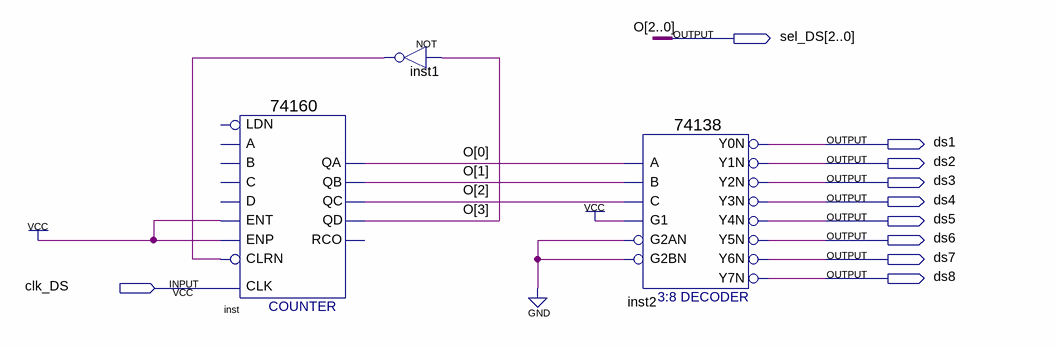
[diagram p0: schematic sheet]
// Quartus schematic dynamic_scanning.bdf as structural Verilog: 3 symbols, 10 pins
module dynamic_scanning (
  input  clk_DS,
  output [2:0] sel_DS,
  output ds1,
  output ds2,
  output ds3,
  output ds4,
  output ds5,
  output ds6,
  output ds7,
  output ds8
);

  wire inst1_out;
  wire [3:3] O;

  \74160  inst (
    .CLK(clk_DS), .ENT(1'b1), .ENP(1'b1), .CLRN(inst1_out), .QD(O[3]), .QA(sel_DS[0]), .QB(sel_DS[1]),
    .QC(sel_DS[2]));  // open: A, B, C, D, LDN, RCO
  not inst1 (inst1_out, O[3]);
  \74138  inst2 (
    .A(sel_DS[0]), .B(sel_DS[1]), .G1(1'b1), .C(sel_DS[2]), .G2AN(1'b0), .G2BN(1'b0), .Y0N(ds1), .Y1N(ds2),
    .Y2N(ds3), .Y3N(ds4), .Y4N(ds5), .Y5N(ds6), .Y6N(ds7), .Y7N(ds8));

  // Other names for the same wires on the sheet: O[2:0] = sel_DS
endmodule
